# Altium project PCB_Project.PrjPcb
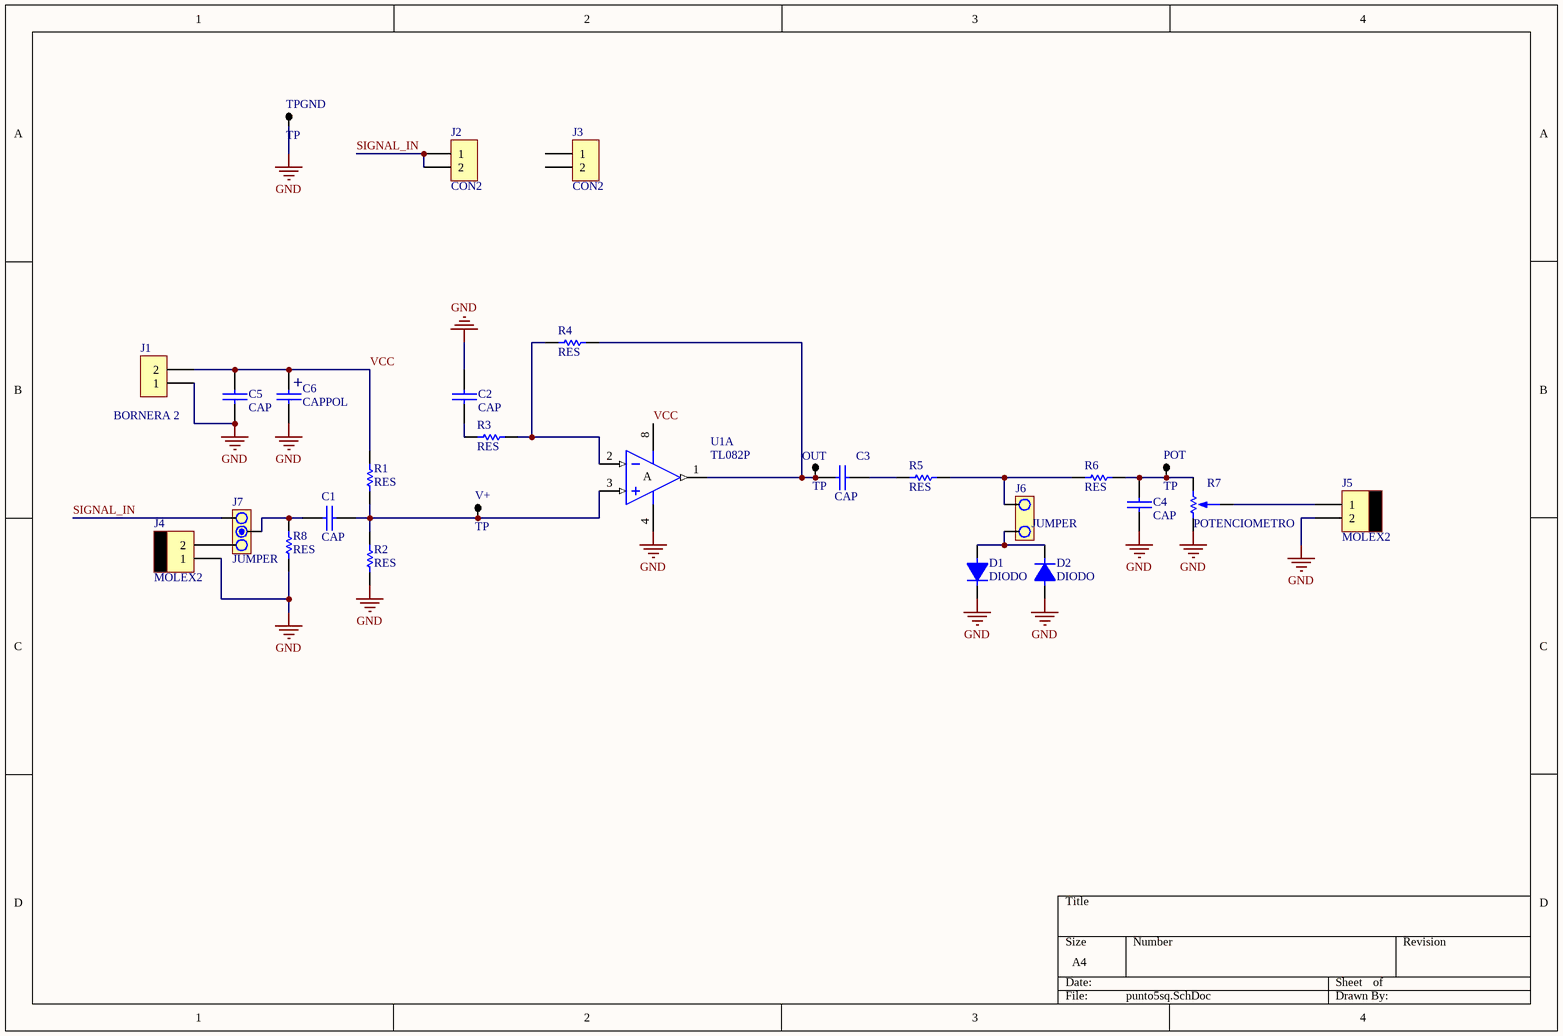
[diagram p0: punto5sq.SchDoc]
1 sheet, 28 parts. Net scope: global (net labels, ports and power ports of the same name join across sheets).
Board file: punto5pcb.PcbDoc

## Sheet punto5sq.SchDoc
size A4

### Parts
C1  CAP  [CAP200]
C2  CAP  [CAP200]
C3  CAP  [CAP200]
C4  CAP  [CAP200]
C5  CAP  [CAP200]
C6  CAPPOL  [CAP100RP]
D1  DIODO  [DO41]
D2  DIODO  [DO41]
J1  BORNERA 2  [BORNERA2]
J2  CON2  [SIP2]
J3  CON2  [SIP2]
J4  MOLEX2  [MOLEX2]
J5  MOLEX2  [MOLEX2]
J6  JUMPER  [JUMPER2]
J7  JUMPER  [JUMPER3]
OUT  TP  [TPTH]
POT  TP  [TPTH]
R1  RES  [RES400]
R2  RES  [RES400]
R3  RES  [RES400]
R4  RES  [RES400]
R5  RES  [RES400]
R6  RES  [RES400]
R7  POTENCIOMETRO  [POTENCIOMETRO]
R8  RES  [RES400]
TPGND  TP  [TPTH]
U1  TL082P  [P008]  (part A of 2)
V+  TP  [TPTH]

### Nets
GND: C2.2 C4.2 C5.2 C6.2 D1.2 D2.1 J1.1 J4.1 J5.2 R2.1 R7.3 R8.2 TPGND.1 U1.4(V-)
SIGNAL_IN: J2.1 J2.2 J7.3
VCC: C5.1 C6.1 J1.2 R1.2 U1.8(V+)
NetC1_1: C1.1 R1.1 R2.2 U1.3(IN+) V+.1
NetC1_2: C1.2 J7.2 R8.1
NetC2_1: C2.1 R3.1
NetC3_1: C3.1 OUT.1 R4.2 U1.1(OUT)
NetC3_2: C3.2 R5.1
NetC4_1: C4.1 POT.1 R6.2 R7.1
NetD1_1: D1.1 D2.2 J6.1
NetJ4_2: J4.2 J7.1
NetJ5_1: J5.1 R7.2
NetJ6_2: J6.2 R5.2 R6.1
NetR3_2: R3.2 R4.1 U1.2(IN-)

Not connected (* = marked no-connect by the designer): J3 1 2

### Notes on the sheet
- (in symbol CAPPOL) +
- (in symbol TL082P, part A) A

### Library data of the parts
J7 = JUMPER3
U1 = TL082P: JFET-Input Operational Amplifier; Published: 16-Jan-2001; LatestRevisionDate: 04-Mar-2005; LatestRevisionNote: Stylized 3D Model Added.; DatasheetVersion: Feb-1999; PackageVersion: Jun-1999; PackageReference: P008; Publisher: Altium Limited; PackageDescription: DIP; 8 Leads; Row Spacing 7.62 mm; Pitch 2.54 mm; Code_JEDEC: MO-001-AN; ComponentLink1Description: Manufacturer Link; ComponentLink1URL: http://www.ti.com/; ComponentLink2Description: Datasheet; ComponentLink2URL: http://www-s.ti.com/sc/ds/tl082.pdf